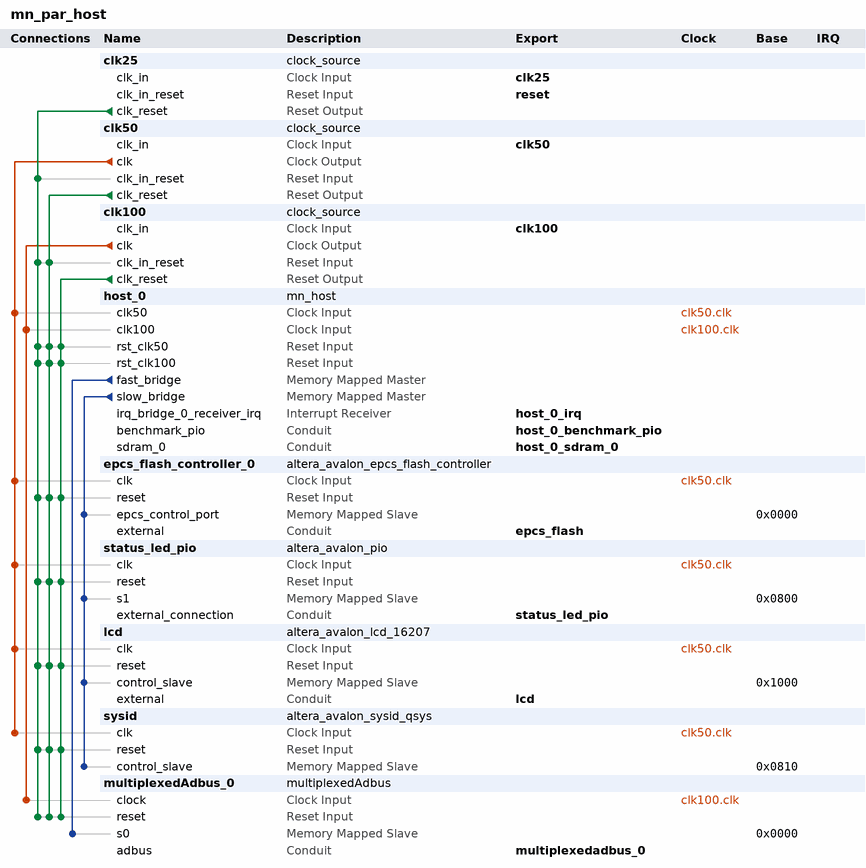
[diagram p0: system contents]
# Platform Designer (Qsys) system mn_par_host, Cyclone IV E EP4CE115F29C7
# Parameters at their usual value, and those the tool derives, are not listed.
package require -exact qsys 13.0
create_system mn_par_host
set_project_property DEVICE_FAMILY {Cyclone IV E}
set_project_property DEVICE EP4CE115F29C7

add_instance clk25 clock_source 13.0
set_instance_parameter_value clk25 clockFrequency 25000000

add_instance clk50 clock_source 13.0
set_instance_parameter_value clk50 clockFrequency 50000000

add_instance clk100 clock_source 13.0
set_instance_parameter_value clk100 clockFrequency 100000000

add_instance host_0 mn_host 1.0

add_instance epcs_flash_controller_0 altera_avalon_epcs_flash_controller 13.0.1.99.2

add_instance status_led_pio altera_avalon_pio 13.0.1.99.2
set_instance_parameter_value status_led_pio direction Output
set_instance_parameter_value status_led_pio width 2

add_instance lcd altera_avalon_lcd_16207 13.0.1.99.2

add_instance sysid altera_avalon_sysid_qsys 13.0
set_instance_parameter_value sysid id 0

add_instance multiplexedAdbus_0 multiplexedAdbus 0.0.1

# connections
add_connection clk50.clk epcs_flash_controller_0.clk clock
add_connection clk50.clk host_0.clk50 clock
add_connection clk50.clk lcd.clk clock
add_connection clk50.clk status_led_pio.clk clock
add_connection clk50.clk sysid.clk clock
add_connection clk100.clk host_0.clk100 clock
add_connection clk100.clk multiplexedAdbus_0.clock clock
add_connection clk25.clk_reset clk50.clk_in_reset reset
add_connection clk25.clk_reset clk100.clk_in_reset reset
add_connection clk25.clk_reset epcs_flash_controller_0.reset reset
add_connection clk25.clk_reset host_0.rst_clk50 reset
add_connection clk25.clk_reset host_0.rst_clk100 reset
add_connection clk25.clk_reset lcd.reset reset
add_connection clk25.clk_reset multiplexedAdbus_0.reset reset
add_connection clk25.clk_reset status_led_pio.reset reset
add_connection clk25.clk_reset sysid.reset reset
add_connection clk50.clk_reset clk100.clk_in_reset reset
add_connection clk50.clk_reset epcs_flash_controller_0.reset reset
add_connection clk50.clk_reset host_0.rst_clk50 reset
add_connection clk50.clk_reset host_0.rst_clk100 reset
add_connection clk50.clk_reset lcd.reset reset
add_connection clk50.clk_reset multiplexedAdbus_0.reset reset
add_connection clk50.clk_reset status_led_pio.reset reset
add_connection clk50.clk_reset sysid.reset reset
add_connection clk100.clk_reset epcs_flash_controller_0.reset reset
add_connection clk100.clk_reset host_0.rst_clk50 reset
add_connection clk100.clk_reset host_0.rst_clk100 reset
add_connection clk100.clk_reset lcd.reset reset
add_connection clk100.clk_reset multiplexedAdbus_0.reset reset
add_connection clk100.clk_reset status_led_pio.reset reset
add_connection clk100.clk_reset sysid.reset reset
add_connection host_0.fast_bridge multiplexedAdbus_0.s0 avalon
set_connection_parameter_value host_0.fast_bridge/multiplexedAdbus_0.s0 baseAddress 0x0000
add_connection host_0.slow_bridge epcs_flash_controller_0.epcs_control_port avalon
set_connection_parameter_value host_0.slow_bridge/epcs_flash_controller_0.epcs_control_port baseAddress 0x0000
add_connection host_0.slow_bridge lcd.control_slave avalon
set_connection_parameter_value host_0.slow_bridge/lcd.control_slave baseAddress 0x1000
add_connection host_0.slow_bridge status_led_pio.s1 avalon
set_connection_parameter_value host_0.slow_bridge/status_led_pio.s1 baseAddress 0x0800
add_connection host_0.slow_bridge sysid.control_slave avalon
set_connection_parameter_value host_0.slow_bridge/sysid.control_slave baseAddress 0x0810

# exported interfaces
add_interface clk50 clock sink
set_interface_property clk50 EXPORT_OF clk50.clk_in
add_interface clk100 clock sink
set_interface_property clk100 EXPORT_OF clk100.clk_in
add_interface clk25 clock sink
set_interface_property clk25 EXPORT_OF clk25.clk_in
add_interface reset reset sink
set_interface_property reset EXPORT_OF clk25.clk_in_reset
add_interface host_0_benchmark_pio conduit end
set_interface_property host_0_benchmark_pio EXPORT_OF host_0.benchmark_pio
add_interface host_0_sdram_0 conduit end
set_interface_property host_0_sdram_0 EXPORT_OF host_0.sdram_0
add_interface epcs_flash conduit end
set_interface_property epcs_flash EXPORT_OF epcs_flash_controller_0.external
add_interface status_led_pio conduit end
set_interface_property status_led_pio EXPORT_OF status_led_pio.external_connection
add_interface multiplexedadbus_0 conduit end
set_interface_property multiplexedadbus_0 EXPORT_OF multiplexedAdbus_0.adbus
add_interface host_0_irq interrupt receiver
set_interface_property host_0_irq EXPORT_OF host_0.irq_bridge_0_receiver_irq
add_interface lcd conduit end
set_interface_property lcd EXPORT_OF lcd.external

set_interconnect_requirement {$system} qsys_mm.clockCrossingAdapter HANDSHAKE
set_interconnect_requirement {$system} qsys_mm.maxAdditionalLatency 0

save_system mn_par_host.qsys
